# EAGLE design small_led_ring (EAGLE 9.4.2)
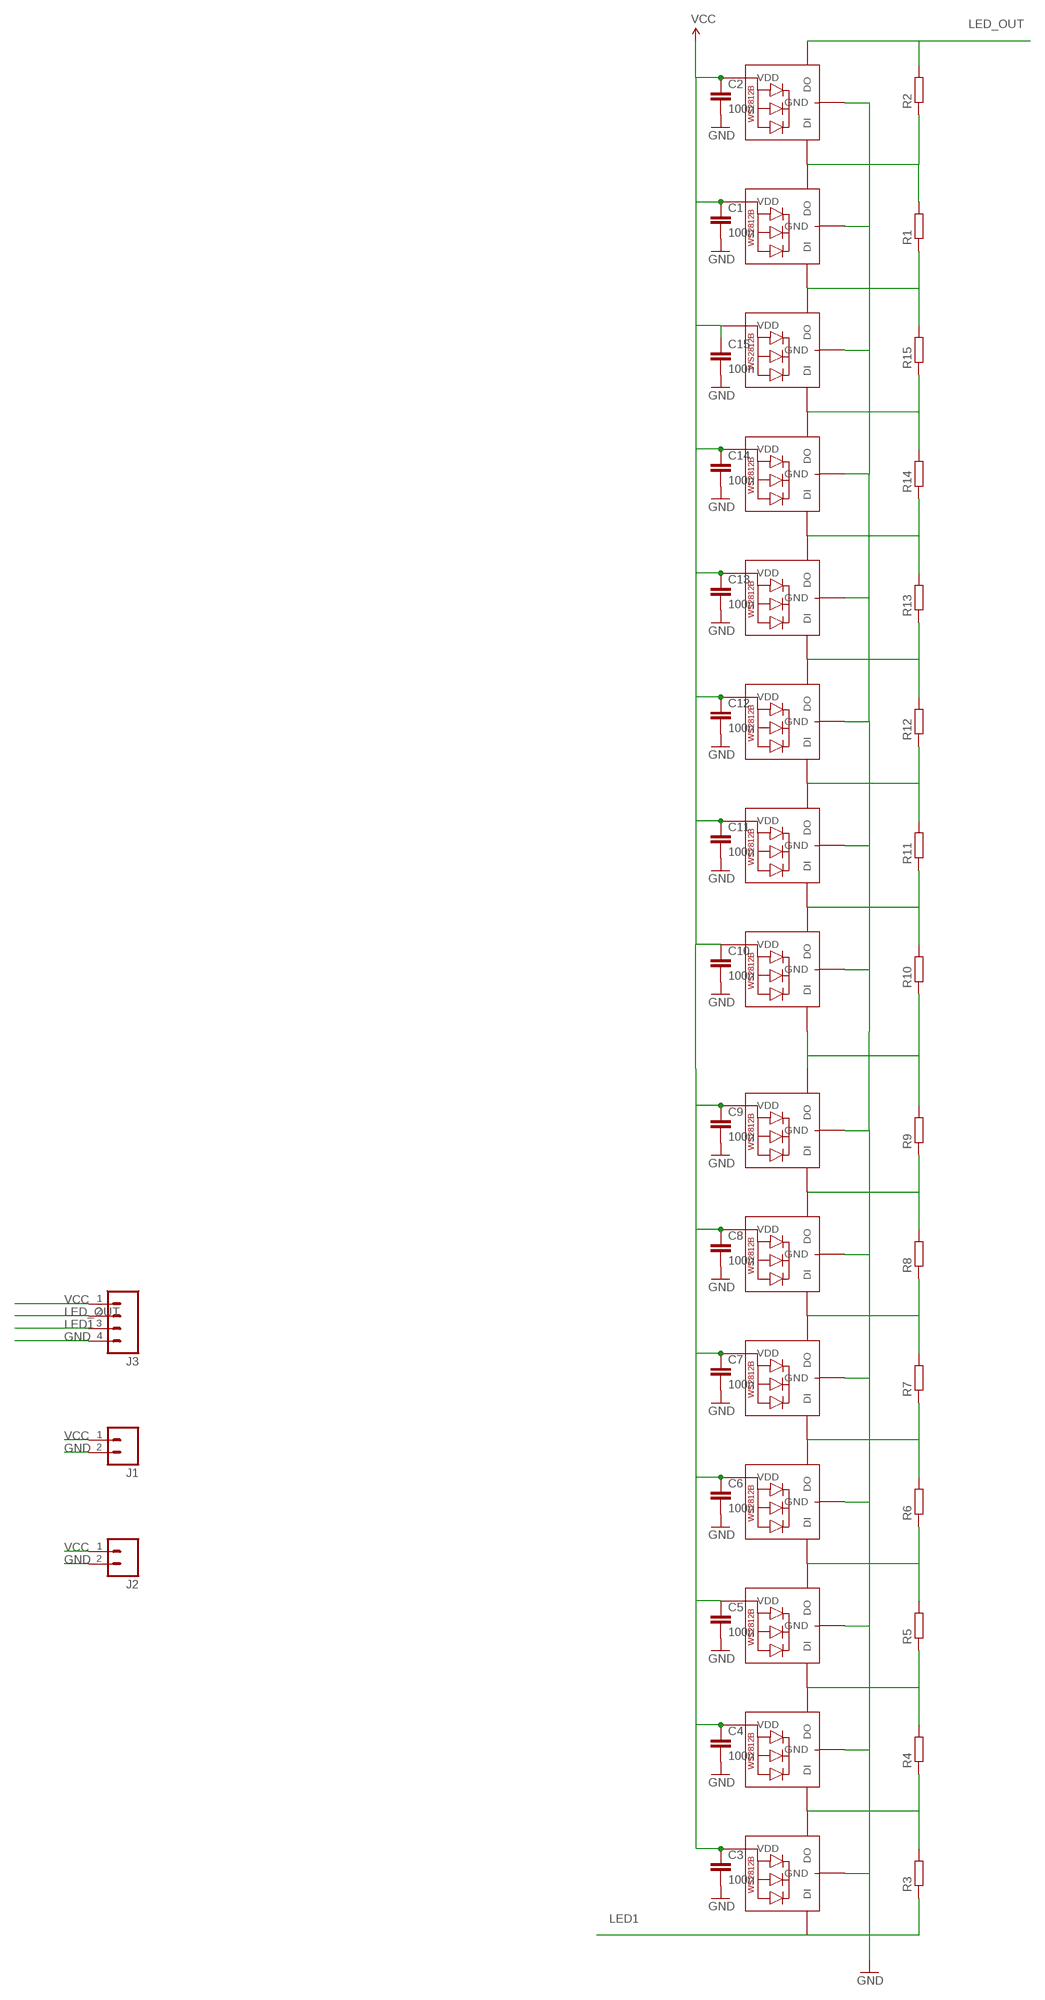
[diagram p0: schematic, sheet 1]

## Parts
C1  100n  CAP0603-CAP  [0603-CAP]
C2  100n  CAP0603-CAP  [0603-CAP]
C3  100n  CAP0603-CAP  [0603-CAP]
C4  100n  CAP0603-CAP  [0603-CAP]
C5  100n  CAP0603-CAP  [0603-CAP]
C6  100n  CAP0603-CAP  [0603-CAP]
C7  100n  CAP0603-CAP  [0603-CAP]
C8  100n  CAP0603-CAP  [0603-CAP]
C9  100n  CAP0603-CAP  [0603-CAP]
C10  100n  CAP0603-CAP  [0603-CAP]
C11  100n  CAP0603-CAP  [0603-CAP]
C12  100n  CAP0603-CAP  [0603-CAP]
C13  100n  CAP0603-CAP  [0603-CAP]
C14  100n  CAP0603-CAP  [0603-CAP]
C15  100n  CAP0603-CAP  [0603-CAP]
J1  M021X02_NO_SILK  [1X02_NO_SILK]
J2  M021X02_NO_SILK  [1X02_NO_SILK]
J3  M04NO_SILK_ALL_ROUND  [1X04_NO_SILK_ALL_ROUND]
LED1  WS2812B3535  [LED3535]
LED2  WS2812B3535  [LED3535]
LED3  WS2812B3535  [LED3535]
LED4  WS2812B3535  [LED3535]
LED5  WS2812B3535  [LED3535]
LED6  WS2812B3535  [LED3535]
LED7  WS2812B3535  [LED3535]
LED8  WS2812B3535  [LED3535]
LED9  WS2812B3535  [LED3535]
LED10  WS2812B3535  [LED3535]
LED11  WS2812B3535  [LED3535]
LED12  WS2812B3535  [LED3535]
LED13  WS2812B3535  [LED3535]
LED14  WS2812B3535  [LED3535]
LED15  WS2812B3535  [LED3535]
R1  R-EU_R0603  [R0603]
R2  R-EU_R0603  [R0603]
R3  R-EU_R0603  [R0603]
R4  R-EU_R0603  [R0603]
R5  R-EU_R0603  [R0603]
R6  R-EU_R0603  [R0603]
R7  R-EU_R0603  [R0603]
R8  R-EU_R0603  [R0603]
R9  R-EU_R0603  [R0603]
R10  R-EU_R0603  [R0603]
R11  R-EU_R0603  [R0603]
R12  R-EU_R0603  [R0603]
R13  R-EU_R0603  [R0603]
R14  R-EU_R0603  [R0603]
R15  R-EU_R0603  [R0603]

## Nets
GND: C1.2 C2.2 C3.2 C4.2 C5.2 C6.2 C7.2 C8.2 C9.2 C10.2 C11.2 C12.2 C13.2 C14.2 C15.2 J1.2 J2.2 J3.4 LED1.4(GND) LED2.4(GND) LED3.4(GND) LED4.4(GND) LED5.4(GND) LED6.4(GND) LED7.4(GND) LED8.4(GND) LED9.4(GND) LED10.4(GND) LED11.4(GND) LED12.4(GND) LED13.4(GND) LED14.4(GND) LED15.4(GND)
LED1: J3.3 LED1.1(DI) R3.1
LED_OUT: J3.2 LED15.3(DO) R2.2
N$1: LED10.3(DO) LED11.1(DI) R12.2 R13.1
N$2: LED11.3(DO) LED12.1(DI) R13.2 R14.1
N$5: LED2.3(DO) LED3.1(DI) R4.2 R5.1
N$6: LED13.3(DO) LED14.1(DI) R1.1 R15.2
N$9: LED12.3(DO) LED13.1(DI) R14.2 R15.1
N$10: LED8.3(DO) LED9.1(DI) R10.2 R11.1
N$11: LED3.3(DO) LED4.1(DI) R5.2 R6.1
N$12: LED14.3(DO) LED15.1(DI) R1.2 R2.1
N$14: LED1.3(DO) LED2.1(DI) R3.2 R4.1
N$17: LED4.3(DO) LED5.1(DI) R6.2 R7.1
N$18: LED5.3(DO) LED6.1(DI) R7.2 R8.1
N$19: LED6.3(DO) LED7.1(DI) R8.2 R9.1
N$22: LED9.3(DO) LED10.1(DI) R11.2 R12.1
N$27: LED7.3(DO) LED8.1(DI) R9.2 R10.1
VCC: C1.1 C2.1 C3.1 C4.1 C5.1 C6.1 C7.1 C8.1 C9.1 C10.1 C11.1 C12.1 C13.1 C14.1 C15.1 J1.1 J2.1 J3.1 LED1.2(VDD) LED2.2(VDD) LED3.2(VDD) LED4.2(VDD) LED5.2(VDD) LED6.2(VDD) LED7.2(VDD) LED8.2(VDD) LED9.2(VDD) LED10.2(VDD) LED11.2(VDD) LED12.2(VDD) LED13.2(VDD) LED14.2(VDD) LED15.2(VDD)

## Library data of the parts
C1-C15 = SparkFun-Capacitors:CAP: Capacitor Standard 0603 ceramic capacitor, and 0.1" leaded capacitor.
J1 J2 = i2c_encoder:M02: Standard 2-pin 0.1" header. Use with - straight break away headers ( PRT-00116) - right angle break away headers (PRT-00553) - swiss pins (PRT-00743) - machine pins (PRT-00117) - female headers (PRT-00115) Molex polarized connector foot print use with: PRT-08233 with associated crimp pins and housings. 2.54_SCREWTERM for use with PRT-10571. 3.5mm Screw Terminal footprints for PRT-08084 5mm Screw Terminal footprints for use with PRT-08432
J3 = i2c_encoder:M04: Header 4 Standard 4-pin 0.1" header. Use with straight break away headers (SKU : PRT-00116), right angle break away headers (PRT-00553), swiss pins (PRT-00743), machine pins (PRT-00117), and female headers (PRT-00115). Molex polarized connector foot print use with SKU : PRT-08231 with associated crimp pins and housings. 1MM SMD Version SKU: PRT-10208; PROD_ID: CONN-09696
LED1-LED3 LED5-LED15 = i2c_encoder:WS2812B
LED4 = i2c_encoder:WS2812B; SPICEPREFIX: E
R1-R15 = rcl:R-EU_: RESISTOR, European symbol

## Board
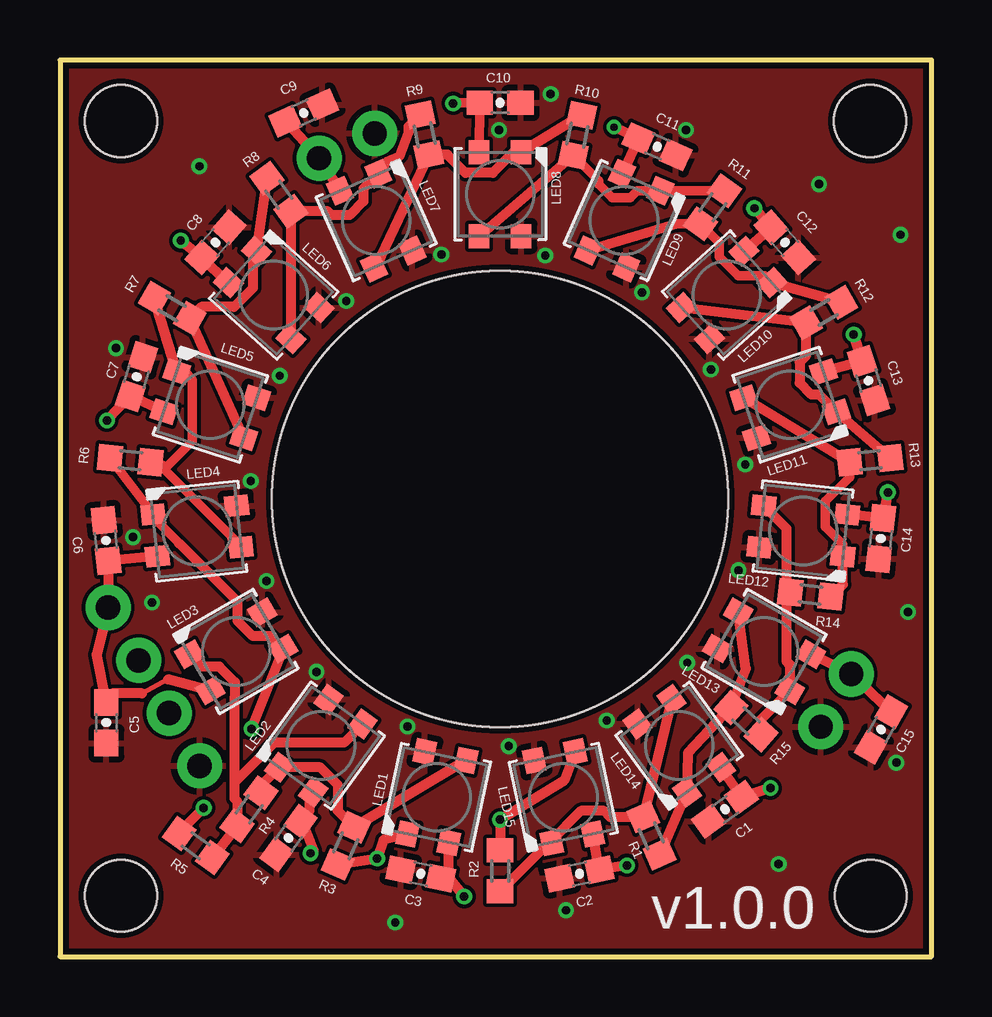
[diagram p1: board, top side]
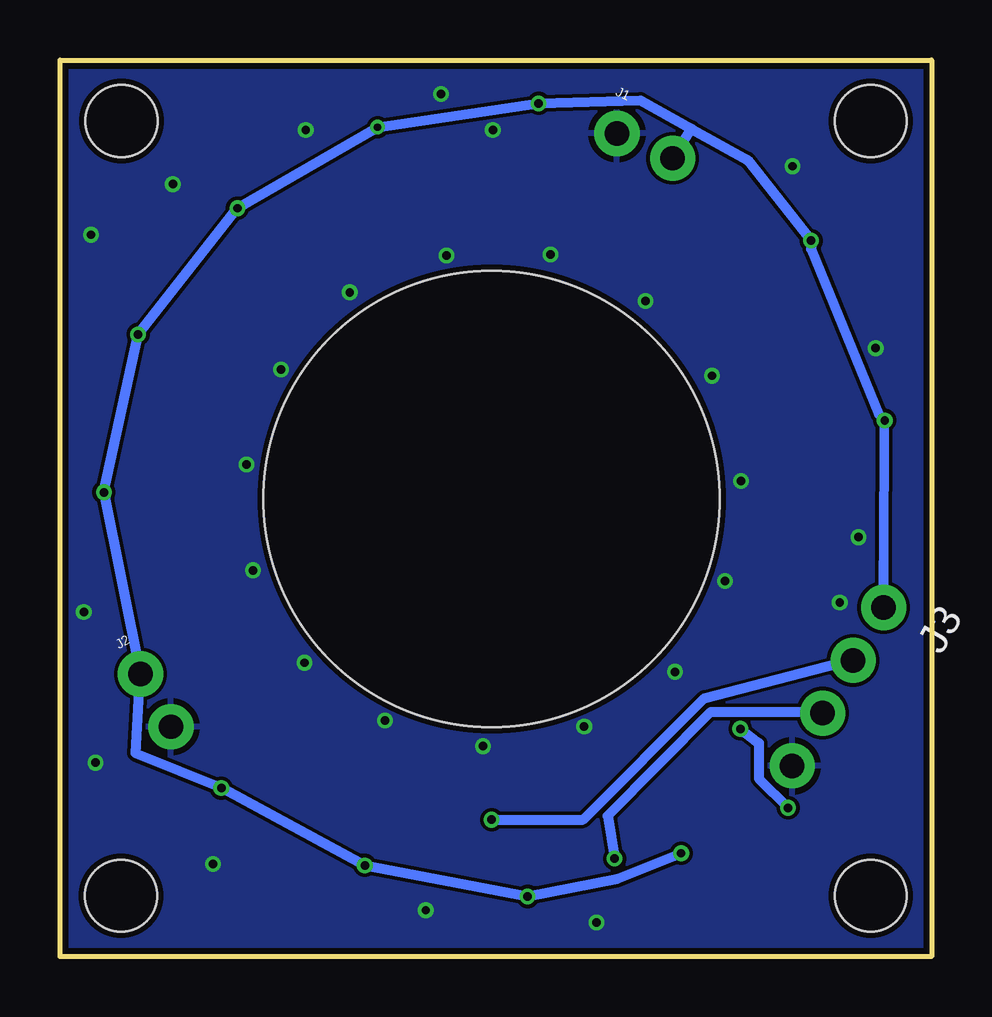
[diagram p2: board, bottom side, seen from below]

Size 36.32 x 37.36 mm. Coordinates in mm from the lower left corner, seen from the top.
Outline: 36.32,0 36.32,37.36 0,37.36 0,0 36.32,0
Copper layers (1*16): Top 0.035mm / dielectric 1.5mm / Bottom 0.035mm
Design rules "SeeedStudio_2layer_DRU_no_angle_20140221": minimum track width 6mil, minimum drill 12mil, track to track 6mil, track to pad 6mil, pad to pad 6mil, via to via 6mil, smd to smd 0mil, copper to edge 10mil, drill to drill 10mil, minimum pad ring 10mil, minimum via ring 6mil, stop-mask expansion 2mil, vias tented up to drill 100mil, thermal gap 10mil
Holes 19 mm at 18.34,19.07
Holes 3 mm at 33.76,34.82 2.54,34.82 33.78,2.54 2.54,2.54

### Footprints (pad centres in the part's own frame; a part is rotated, then mirrored left to right if it is on the bottom)
0603-CAP = smd 1.1 x 1: 1 -0.85,0; 2 0.85,0
1X02_NO_SILK = drill 1.016 pad 1.88: 1 0,0; 2 2.54,0
1X04_NO_SILK_ALL_ROUND = drill 1.016 pad 1.88: 1 0,0; 2 2.54,0; 3 5.08,0; 4 7.62,0
LED3535 = smd 1 x 0.85: 1 -1.75,0.875; 2 -1.75,-0.875; 3 1.75,-0.875; 4 1.75,0.875
R0603 = smd 1 x 1.1: 1 -0.85,0; 2 0.85,0

### Placement (x,y rotation side)
C1  27.71,6.15 216 top
C2  21.64,3.45 192 top
C3  15.03,3.45 168 top
C4  9.52,4.95 234 top
C5  1.93,9.75 270 top
C6  1.92,17.34 96 top
C7  3.2,24.17 72 top
C8  6.48,29.76 48 top
C9  10.16,35.16 24 top
C10  18.34,35.58 0 top
C11  24.88,33.75 336 top
C12  30.2,29.76 312 top
C13  33.68,24 288 top
C14  34.2,17.42 264 top
C15  34.21,9.47 240 top
J1  10.79,33.27 156 bottom
J2  32.97,11.78 300 bottom
J3  2.01,14.55 240 bottom
LED1  15.7,6.65 78 top
LED2  10.87,8.8 54 top
LED3  7.34,12.72 30 top
LED4  5.71,17.74 6 top
LED5  6.26,22.99 342 top
LED6  8.9,27.57 318 top
LED7  13.17,30.67 294 top
LED8  18.34,31.77 270 top
LED9  23.5,30.67 246 top
LED10  27.78,27.57 222 top
LED11  30.42,22.99 198 top
LED12  30.97,17.74 174 top
LED13  29.34,12.72 150 top
LED14  25.8,8.8 126 top
LED15  20.98,6.65 102 top
R1  24.64,5.04 114 top
R2  18.34,3.58 90 top
R3  11.91,4.62 66 top
R4  7.88,6.15 234 top
R5  5.66,4.63 144 top
R6  2.93,20.69 354 top
R7  4.67,27.02 330 top
R8  9.12,31.74 306 top
R9  15.19,34.25 282 top
R10  21.56,34.23 258 top
R11  27.19,31.22 234 top
R12  31.83,26.84 210 top
R13  33.75,20.69 186 top
R14  31.27,15.1 174 top
R15  28.58,9.82 138 top

### Tracks (layer width: path | path; a pad name or v marks a point on that pad's centre or on a via)
GND  (via drill 0.35)
  other vias: 10.69,11.87 14.48,9.6 18.7,8.77 22.78,9.85 28.28,16.1 28.55,20.51 27.12,24.47 24.25,27.68 15.89,29.25 11.93,27.32 9.16,24.21 7.95,19.82 3.05,17.48 2.34,25.36 18.29,34.45 31.62,32.19 29.94,3.87 21.08,1.94 8.61,15.65 26.13,12.25 20.22,29.22 5.81,32.94 26.08,34.45 20.45,35.95 35.33,14.36 13.97,1.43 35.02,30.08 34.85,8.08 3.83,14.76
  pour Top: -2.13,40.59 39.65,40.59 39.65,-3.86 -2.13,-3.86
  pour Bottom: -2.13,40.59 39.65,40.59 39.65,-3.86 -2.13,-3.86
LED1  (via drill 0.35)
  Top 0.406: R3.1 v13.22,4.09 13.49,4.87 LED1.1
  Bottom 0.406: 4.55,10.38 J3.3 4.6,10.2 9.2,10.2 13.5,5.87 v13.22,4.09
LED_OUT  (via drill 0.35)
  Top 0.406: R2.2 v18.34,5.71 21.01,7.34 LED15.3
  Bottom 0.406: v18.34,5.71 14.52,5.71 9.47,10.76 3.4,12.35 J3.2
N$1
  Top 0.4: R13.1 LED11.1
  Top 0.406: LED10.3 R12.2 31.09,25.05 30.82,24.78 30.82,23.91 31.31,23.43 31.63,23.43 LED11.1
N$2
  Top 0.4: LED12.1 32.62,17.18 31.89,17.91 31.89,18.97 32.9,19.98 R13.2 LED11.3
  Top 0.406: LED12.1 32.62,15.51 R14.1
N$5
  Top 0.406: 7.38,5.17 R4.2 | R4.2 R5.1 | R4.2 7.38,6.48 7.27,6.6 7.27,7.26 | LED2.3 11.84,8.92 8.93,8.92 7.27,7.26 | LED3.1 5.9,12.09 6.64,12.09 7.29,11.44 7.29,10.81 7.27,10.79 7.27,7.26
N$6
  Top 0.406: LED13.3 28.58,12.01 R15.2 26.16,8.48 LED14.1 | 26.12,6.66 LED14.1 | LED14.1 R1.1
N$9
  Top 0.406: R15.1 29.21,9.89 LED13.1 30.42,12.18 30.26,12.33 30.26,15.08 | R14.2 30.26,15.08 | LED12.3 30.26,17.85 30.26,15.08
N$10
  Top 0.4: LED8.3 R10.2 22.44,32.33 22.44,32.19 23.01,31.62 23.76,31.62 24.06,31.91 LED9.1 R11.1
N$11  (via drill 0.35)
  Top 0.4: R6.1 LED4.1 3.88,18.32 4.97,17.23
  Top 0.406: v5.99,6.2 4.97,5.18 R5.2 | v7.98,9.49 LED3.3 8.78,13.35 8.04,13.35 7.39,14 7.39,14.8 4.97,17.23
  Bottom 0.406: v5.99,6.2 7.21,7.42 7.21,8.9 v7.98,9.49
N$12
  Top 0.406: 20.37,4.75 R2.1 | LED15.1 20.37,4.75 | 20.37,4.75 20.38,4.75 21.7,6.07 22.67,6.07 22.92,5.82 R1.2 LED14.3
N$14
  Top 0.406: LED1.3 R3.2 11.57,6.09 11.57,7.17 10.85,7.89 LED2.1 8.25,7.01 R4.1
N$17
  Top 0.4: LED5.1 5.2,24.37 5.52,24.05 5.52,21.49 4.43,20.4 4.26,20.4 7.54,17.11 LED4.3
  Top 0.406: LED5.1 R7.1 | 4.43,20.4 R6.2
N$18
  Top 0.406: LED5.3 R7.2 5.89,27.08 7.25,27.08 8.03,27.86 8.03,29.24 LED6.1 R8.1
N$19
  Top 0.406: LED6.3 R8.2 11.16,31.06 11.32,30.9 12.07,30.9 12.64,31.47 12.64,32.01 LED7.1 13.6,33.1 14.13,33.34 14.52,34.34 14.52,34.58 R9.1
N$22
  Top 0.4: LED10.1 29.37,28.38 28.26,28.38 27.48,29.16 27.48,29.75 R11.2 25.69,30.54 22.01,29.43 LED9.3
  Top 0.406: R12.1 LED10.1
N$27
  Top 0.406: R10.1 LED8.1 18.89,33.52 18.04,32.66 16.89,32.66 16.14,33.42 R9.2 13.21,28.84 LED7.3
VCC  (via drill 0.3, 0.35)
  Top 0.203: 4.5,11.55 3.43,10.97
  Top 0.4: v29.6,7.03 29.47,6.95 | C10.1 LED8.2
  Top 0.406: 16.19,3.31 C3.1 | v10.44,4.31 10.57,4.44 10.11,5.6 10.07,5.63 C4.1 10.38,6.04 10.38,6.69 LED2.2 | LED5.2 C7.1 v1.96,22.35 | LED6.2 C8.1 v5.03,29.84 | 16.19,3.31 LED1.2 | v16.84,2.51 16.19,3.31 | C2.1 22.2,3.58 | 34.3,18.4 C14.1 | LED9.2 C11.1 v23.09,34.56 | C14.1 LED12.2 | LED10.2 28.54,29.44 C12.1 v28.93,31.19 | LED11.2 C13.1 v33.07,25.93 | LED14.2 C1.1 v29.6,7.03 | C2.1 LED15.2 | 3.43,10.97 2.19,10.97 2.01,10.79 C5.1 1.52,12.59 J3.1 C6.1 LED4.2 | LED3.2 4.5,11.55 | C15.1 J2.1 LED13.2 | v34.49,19.35 C14.1 | C10.1 v16.38,35.55 | v23.62,3.81 C2.1 | C9.1 9.77,34.43 J1.1 11.66,31.95 LED7.2
  Bottom 0.4: 2,16.45 1.98,22.32
  Bottom 0.406: 1.98,22.32 v1.96,22.35 2.21,22.6 5.03,29.48 v5.03,29.84 7.67,33.19 9.99,34.49 10.01,34.5 | v29.6,7.03 29.55,7.03 | 29.55,7.03 33.17,8.48 J2.1 v34.49,19.35 v33.07,25.93 v28.93,31.19 v23.09,34.56 v16.38,35.55 12.14,35.68 10.03,34.51 10.01,34.5 | 29.55,7.03 v23.62,3.81 v16.84,2.51 13.11,3.25 v10.44,4.31 | J1.1 10.01,34.5 | J3.1 2,16.45

### Text on the board
tNames: v1.0.0
Document: the height of an SK6812 is 1.6mm where / as the height for a smd encoder is ~4.5mm | Siirrä X3 ylemmäs? | use WS2812B or SK6812 to save on gpio pins | (0.1 -0.03) | GPIO needed: / I2C: 2 / SPI: 4 (+ interrupt?) / encoder: 2 / leds: 1 / = 5 - 7(/8) | (-0.1 -0.03) | (c> 2 1.9) | 0.5mm FFC max current = 0.55A / http://www.axon-cable.com/publications/FFC-Flat-Cables.pdf | CUTOUT | CUTOUT | F+M headerit päällekkäin on noin 5.1mm? | kooderin korkeus 4+(5-7 kierteet)mm | (0.03 0.1)